# Altium schematic sheet REDRIVERS.SchDoc
size A3; SheetNumber: 6; SheetTotal: 8
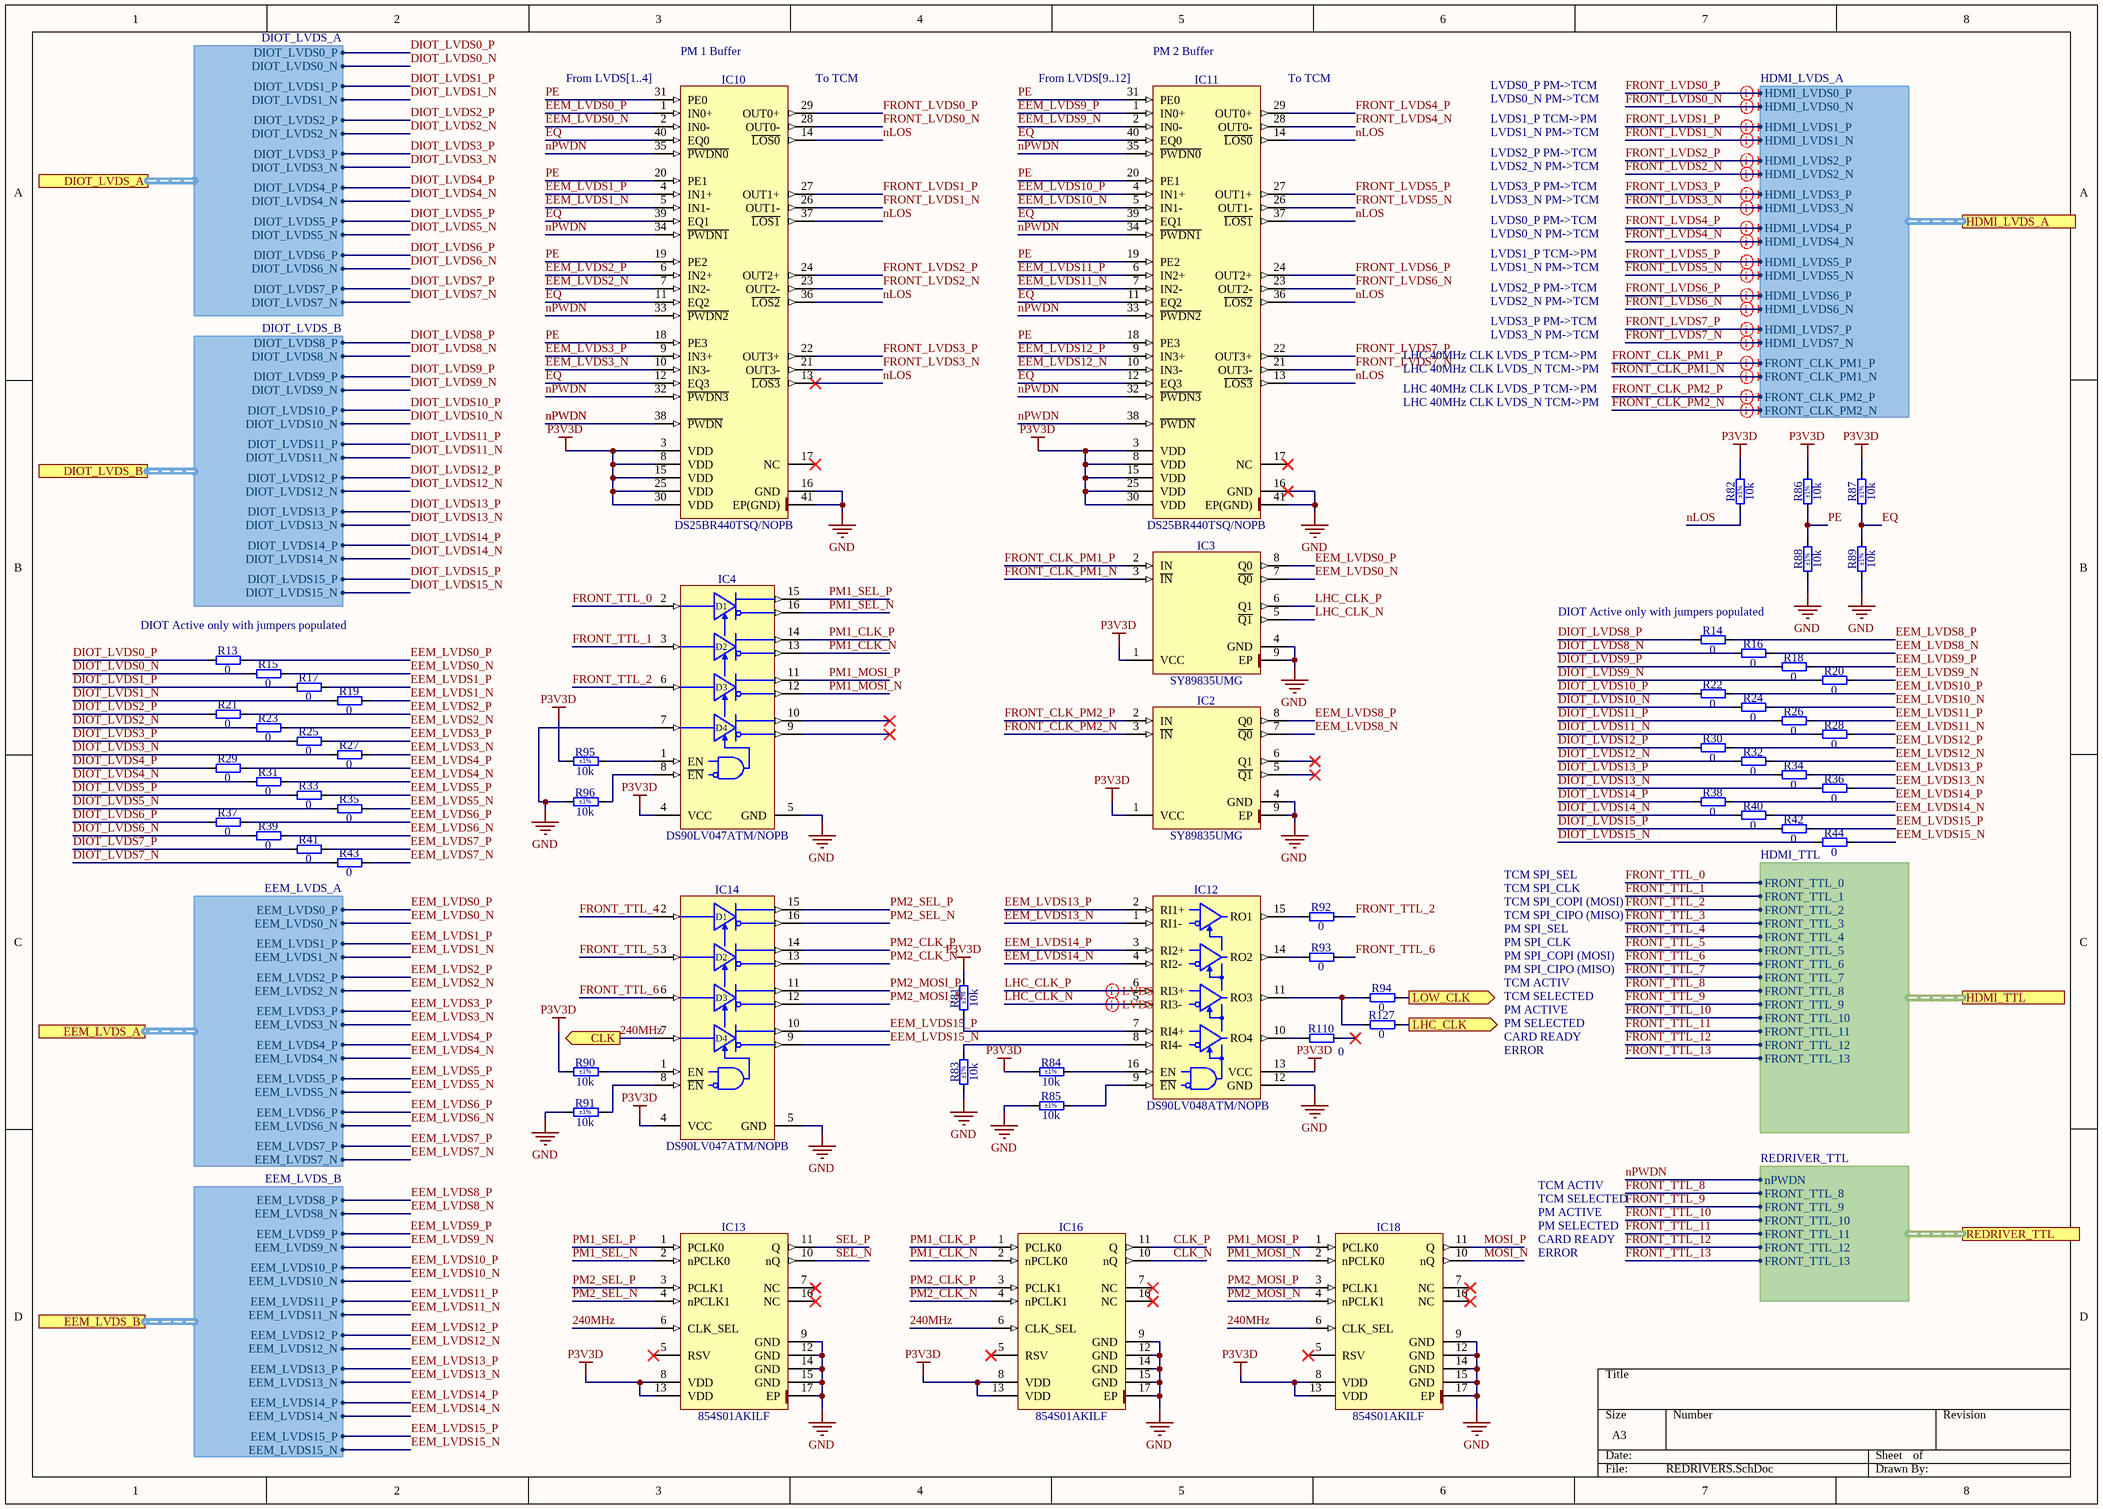
[diagram p0: REDRIVERS.SchDoc]

## Parts
IC2  SY89835UMG  [SON50P200X200X90-9N-R70X130]
IC3  SY89835UMG  [SON50P200X200X90-9N-R70X130]
IC4  DS90LV047ATM/NOPB  [SOIC127P600X175-16N]
IC10  DS25BR440TSQ/NOPB  [QFN50P600X600X80-41N-S480]
IC11  DS25BR440TSQ/NOPB  [QFN50P600X600X80-41N-S480]
IC12  DS90LV048ATM/NOPB  [SOIC127P600X175-16N]
IC13  854S01AKILF  [QFN50P300X300X100-17N-S180]
IC14  DS90LV047ATM/NOPB  [SOIC127P600X175-16N]
IC16  854S01AKILF  [QFN50P300X300X100-17N-S180]
IC18  854S01AKILF  [QFN50P300X300X100-17N-S180]
R13  0  [RESC1005X40N]
R14  0  [RESC1005X40N]
R15  0  [RESC1005X40N]
R16  0  [RESC1005X40N]
R17  0  [RESC1005X40N]
R18  0  [RESC1005X40N]
R19  0  [RESC1005X40N]
R20  0  [RESC1005X40N]
R21  0  [RESC1005X40N]
R22  0  [RESC1005X40N]
R23  0  [RESC1005X40N]
R24  0  [RESC1005X40N]
R25  0  [RESC1005X40N]
R26  0  [RESC1005X40N]
R27  0  [RESC1005X40N]
R28  0  [RESC1005X40N]
R29  0  [RESC1005X40N]
R30  0  [RESC1005X40N]
R31  0  [RESC1005X40N]
R32  0  [RESC1005X40N]
R33  0  [RESC1005X40N]
R34  0  [RESC1005X40N]
R35  0  [RESC1005X40N]
R36  0  [RESC1005X40N]
R37  0  [RESC1005X40N]
R38  0  [RESC1005X40N]
R39  0  [RESC1005X40N]
R40  0  [RESC1005X40N]
R41  0  [RESC1005X40N]
R42  0  [RESC1005X40N]
R43  0  [RESC1005X40N]
R44  0  [RESC1005X40N]
R81  10k  Tolerance: ±1%  [RESC1608X55N]
R82  10k  Tolerance: ±1%  [RESC1608X55N]
R83  10k  Tolerance: ±1%  [RESC1608X55N]
R84  10k  Tolerance: ±1%  [RESC1608X55N]
R85  10k  Tolerance: ±1%  [RESC1608X55N]
R86  10k  Tolerance: ±1%  [RESC1608X55N]
R87  10k  Tolerance: ±1%  [RESC1608X55N]
R88  10k  Tolerance: ±1%  [RESC1608X55N]
R89  10k  Tolerance: ±1%  [RESC1608X55N]
R90  10k  Tolerance: ±1%  [RESC1608X55N]
R91  10k  Tolerance: ±1%  [RESC1608X55N]
R92  0  [RESC1005X40N]
R93  0  [RESC1005X40N]
R94  0  [RESC1005X40N]
R95  10k  Tolerance: ±1%  [RESC1608X55N]
R96  10k  Tolerance: ±1%  [RESC1608X55N]
R110  0  [RESC1005X40N]
R127  0  [RESC1005X40N]

## Ports
CLK (out, see BLOCK_DIAGRAM[3B], CLK_GEN[6B]), DIOT_LVDS_A (harness DIOT_LVDS_A, see BLOCK_DIAGRAM[3A], DIOT_CONN[3C]), DIOT_LVDS_B (harness DIOT_LVDS_B, see BLOCK_DIAGRAM[3A], DIOT_CONN[6C]), EEM_LVDS_A (harness EEM_LVDS_A, see BLOCK_DIAGRAM[3C], EEM_CONN[3A]), EEM_LVDS_B (harness EEM_LVDS_B, see BLOCK_DIAGRAM[3C], EEM_CONN[6A]), HDMI_LVDS_A (harness HDMI_LVDS_A, see BLOCK_DIAGRAM[3B], FRONT_CONN[8A]), HDMI_TTL (harness HDMI_TTL, see BLOCK_DIAGRAM[3B], FRONT_CONN[8C]), LHC_CLK (out, see BLOCK_DIAGRAM[3B], FRONT_CONN[2B]), LOW_CLK (out, see BLOCK_DIAGRAM[3B], CLK_GEN[2B]), REDRIVER_TTL (harness REDRIVER_TTL, see BLOCK_DIAGRAM[3C], SYSTEM[1D])

## Harnesses
DIOT_LVDS_A: DIOT_LVDS0_P, DIOT_LVDS0_N, DIOT_LVDS1_P, DIOT_LVDS1_N, DIOT_LVDS2_P, DIOT_LVDS2_N, DIOT_LVDS3_P, DIOT_LVDS3_N, DIOT_LVDS4_P, DIOT_LVDS4_N, DIOT_LVDS5_P, DIOT_LVDS5_N, DIOT_LVDS6_P, DIOT_LVDS6_N, DIOT_LVDS7_P, DIOT_LVDS7_N
DIOT_LVDS_B: DIOT_LVDS8_P, DIOT_LVDS8_N, DIOT_LVDS9_P, DIOT_LVDS9_N, DIOT_LVDS10_P, DIOT_LVDS10_N, DIOT_LVDS11_P, DIOT_LVDS11_N, DIOT_LVDS12_P, DIOT_LVDS12_N, DIOT_LVDS13_P, DIOT_LVDS13_N, DIOT_LVDS14_P, DIOT_LVDS14_N, DIOT_LVDS15_P, DIOT_LVDS15_N
EEM_LVDS_A: EEM_LVDS0_P, EEM_LVDS0_N, EEM_LVDS1_P, EEM_LVDS1_N, EEM_LVDS2_P, EEM_LVDS2_N, EEM_LVDS3_P, EEM_LVDS3_N, EEM_LVDS4_P, EEM_LVDS4_N, EEM_LVDS5_P, EEM_LVDS5_N, EEM_LVDS6_P, EEM_LVDS6_N, EEM_LVDS7_P, EEM_LVDS7_N
EEM_LVDS_B: EEM_LVDS8_P, EEM_LVDS8_N, EEM_LVDS9_P, EEM_LVDS9_N, EEM_LVDS10_P, EEM_LVDS10_N, EEM_LVDS11_P, EEM_LVDS11_N, EEM_LVDS12_P, EEM_LVDS12_N, EEM_LVDS13_P, EEM_LVDS13_N, EEM_LVDS14_P, EEM_LVDS14_N, EEM_LVDS15_P, EEM_LVDS15_N
REDRIVER_TTL: nPWDN, FRONT_TTL_8, FRONT_TTL_9, FRONT_TTL_10, FRONT_TTL_11, FRONT_TTL_12, FRONT_TTL_13
HDMI_LVDS_A: HDMI_LVDS0_P, HDMI_LVDS0_N, HDMI_LVDS1_P, HDMI_LVDS1_N, HDMI_LVDS2_P, HDMI_LVDS2_N, HDMI_LVDS3_P, HDMI_LVDS3_N, HDMI_LVDS4_P, HDMI_LVDS4_N, HDMI_LVDS5_P, HDMI_LVDS5_N, HDMI_LVDS6_P, HDMI_LVDS6_N, HDMI_LVDS7_P, HDMI_LVDS7_N, FRONT_CLK_PM1_P, FRONT_CLK_PM1_N, FRONT_CLK_PM2_P, FRONT_CLK_PM2_N
HDMI_TTL: FRONT_TTL_0, FRONT_TTL_1, FRONT_TTL_2, FRONT_TTL_3, FRONT_TTL_4, FRONT_TTL_5, FRONT_TTL_6, FRONT_TTL_7, FRONT_TTL_8, FRONT_TTL_9, FRONT_TTL_10, FRONT_TTL_11, FRONT_TTL_12, FRONT_TTL_13

## Nets
GND: IC2.4(GND) IC2.9(EP) IC3.4(GND) IC3.9(EP) IC4.5(GND) IC4.7(DIN4) IC10.16(GND) IC10.41(EP(GND)) IC11.16(GND) IC11.41(EP(GND)) IC12.12(GND) IC13.9(GND) IC13.12(GND) IC13.14(GND) IC13.15(GND) IC13.17(EP) IC14.5(GND) IC16.9(GND) IC16.12(GND) IC16.14(GND) IC16.15(GND) IC16.17(EP) IC18.9(GND) IC18.12(GND) IC18.14(GND) IC18.15(GND) IC18.17(EP) R83.1 R85.1 R88.1 R89.1 R91.2 R96.2
P3V3D: IC2.1(VCC) IC3.1(VCC) IC4.4(VCC) IC10.3(VDD) IC10.8(VDD) IC10.15(VDD) IC10.25(VDD) IC10.30(VDD) IC11.3(VDD) IC11.8(VDD) IC11.15(VDD) IC11.25(VDD) IC11.30(VDD) IC12.13(VCC) IC13.8(VDD) IC13.13(VDD) IC14.4(VCC) IC16.8(VDD) IC16.13(VDD) IC18.8(VDD) IC18.13(VDD) R81.2 R82.2 R84.1 R86.2 R87.2 R90.2 R95.2
240MHz: IC13.6(CLK_SEL) IC14.7(DIN4) IC16.6(CLK_SEL) IC18.6(CLK_SEL) ; port CLK
CLK_N: IC16.10(nQ)
CLK_P: IC16.11(Q)
DIOT_LVDS0_N: R15.1 ; port DIOT_LVDS_A.DIOT_LVDS0_N
DIOT_LVDS0_P: R13.1 ; port DIOT_LVDS_A.DIOT_LVDS0_P
DIOT_LVDS1_N: R19.1 ; port DIOT_LVDS_A.DIOT_LVDS1_N
DIOT_LVDS1_P: R17.1 ; port DIOT_LVDS_A.DIOT_LVDS1_P
DIOT_LVDS2_N: R23.1 ; port DIOT_LVDS_A.DIOT_LVDS2_N
DIOT_LVDS2_P: R21.1 ; port DIOT_LVDS_A.DIOT_LVDS2_P
DIOT_LVDS3_N: R27.1 ; port DIOT_LVDS_A.DIOT_LVDS3_N
DIOT_LVDS3_P: R25.1 ; port DIOT_LVDS_A.DIOT_LVDS3_P
DIOT_LVDS4_N: R31.1 ; port DIOT_LVDS_A.DIOT_LVDS4_N
DIOT_LVDS4_P: R29.1 ; port DIOT_LVDS_A.DIOT_LVDS4_P
DIOT_LVDS5_N: R35.1 ; port DIOT_LVDS_A.DIOT_LVDS5_N
DIOT_LVDS5_P: R33.1 ; port DIOT_LVDS_A.DIOT_LVDS5_P
DIOT_LVDS6_N: R39.1 ; port DIOT_LVDS_A.DIOT_LVDS6_N
DIOT_LVDS6_P: R37.1 ; port DIOT_LVDS_A.DIOT_LVDS6_P
DIOT_LVDS7_N: R43.1 ; port DIOT_LVDS_A.DIOT_LVDS7_N
DIOT_LVDS7_P: R41.1 ; port DIOT_LVDS_A.DIOT_LVDS7_P
DIOT_LVDS8_N: R16.1 ; port DIOT_LVDS_B.DIOT_LVDS8_N
DIOT_LVDS8_P: R14.1 ; port DIOT_LVDS_B.DIOT_LVDS8_P
DIOT_LVDS9_N: R20.1 ; port DIOT_LVDS_B.DIOT_LVDS9_N
DIOT_LVDS9_P: R18.1 ; port DIOT_LVDS_B.DIOT_LVDS9_P
DIOT_LVDS10_N: R24.1 ; port DIOT_LVDS_B.DIOT_LVDS10_N
DIOT_LVDS10_P: R22.1 ; port DIOT_LVDS_B.DIOT_LVDS10_P
DIOT_LVDS11_N: R28.1 ; port DIOT_LVDS_B.DIOT_LVDS11_N
DIOT_LVDS11_P: R26.1 ; port DIOT_LVDS_B.DIOT_LVDS11_P
DIOT_LVDS12_N: R32.1 ; port DIOT_LVDS_B.DIOT_LVDS12_N
DIOT_LVDS12_P: R30.1 ; port DIOT_LVDS_B.DIOT_LVDS12_P
DIOT_LVDS13_N: R36.1 ; port DIOT_LVDS_B.DIOT_LVDS13_N
DIOT_LVDS13_P: R34.1 ; port DIOT_LVDS_B.DIOT_LVDS13_P
DIOT_LVDS14_N: R40.1 ; port DIOT_LVDS_B.DIOT_LVDS14_N
DIOT_LVDS14_P: R38.1 ; port DIOT_LVDS_B.DIOT_LVDS14_P
DIOT_LVDS15_N: R44.1 ; port DIOT_LVDS_B.DIOT_LVDS15_N
DIOT_LVDS15_P: R42.1 ; port DIOT_LVDS_B.DIOT_LVDS15_P
EEM_LVDS0_N: IC3.7(~{Q0}) IC10.2(IN0-) R15.2 ; port EEM_LVDS_A.EEM_LVDS0_N
EEM_LVDS0_P: IC3.8(Q0) IC10.1(IN0+) R13.2 ; port EEM_LVDS_A.EEM_LVDS0_P
EEM_LVDS1_N: IC10.5(IN1-) R19.2 ; port EEM_LVDS_A.EEM_LVDS1_N
EEM_LVDS1_P: IC10.4(IN1+) R17.2 ; port EEM_LVDS_A.EEM_LVDS1_P
EEM_LVDS2_N: IC10.7(IN2-) R23.2 ; port EEM_LVDS_A.EEM_LVDS2_N
EEM_LVDS2_P: IC10.6(IN2+) R21.2 ; port EEM_LVDS_A.EEM_LVDS2_P
EEM_LVDS3_N: IC10.10(IN3-) R27.2 ; port EEM_LVDS_A.EEM_LVDS3_N
EEM_LVDS3_P: IC10.9(IN3+) R25.2 ; port EEM_LVDS_A.EEM_LVDS3_P
EEM_LVDS4_N: R31.2 ; port EEM_LVDS_A.EEM_LVDS4_N
EEM_LVDS4_P: R29.2 ; port EEM_LVDS_A.EEM_LVDS4_P
EEM_LVDS5_N: R35.2 ; port EEM_LVDS_A.EEM_LVDS5_N
EEM_LVDS5_P: R33.2 ; port EEM_LVDS_A.EEM_LVDS5_P
EEM_LVDS6_N: R39.2 ; port EEM_LVDS_A.EEM_LVDS6_N
EEM_LVDS6_P: R37.2 ; port EEM_LVDS_A.EEM_LVDS6_P
EEM_LVDS7_N: R43.2 ; port EEM_LVDS_A.EEM_LVDS7_N
EEM_LVDS7_P: R41.2 ; port EEM_LVDS_A.EEM_LVDS7_P
EEM_LVDS8_N: IC2.7(~{Q0}) R16.2 ; port EEM_LVDS_B.EEM_LVDS8_N
EEM_LVDS8_P: IC2.8(Q0) R14.2 ; port EEM_LVDS_B.EEM_LVDS8_P
EEM_LVDS9_N: IC11.2(IN0-) R20.2 ; port EEM_LVDS_B.EEM_LVDS9_N
EEM_LVDS9_P: IC11.1(IN0+) R18.2 ; port EEM_LVDS_B.EEM_LVDS9_P
EEM_LVDS10_N: IC11.5(IN1-) R24.2 ; port EEM_LVDS_B.EEM_LVDS10_N
EEM_LVDS10_P: IC11.4(IN1+) R22.2 ; port EEM_LVDS_B.EEM_LVDS10_P
EEM_LVDS11_N: IC11.7(IN2-) R28.2 ; port EEM_LVDS_B.EEM_LVDS11_N
EEM_LVDS11_P: IC11.6(IN2+) R26.2 ; port EEM_LVDS_B.EEM_LVDS11_P
EEM_LVDS12_N: IC11.10(IN3-) R32.2 ; port EEM_LVDS_B.EEM_LVDS12_N
EEM_LVDS12_P: IC11.9(IN3+) R30.2 ; port EEM_LVDS_B.EEM_LVDS12_P
EEM_LVDS13_N: IC12.1(RI1-) R36.2 ; port EEM_LVDS_B.EEM_LVDS13_N
EEM_LVDS13_P: IC12.2(RI1+) R34.2 ; port EEM_LVDS_B.EEM_LVDS13_P
EEM_LVDS14_N: IC12.4(RI2-) R40.2 ; port EEM_LVDS_B.EEM_LVDS14_N
EEM_LVDS14_P: IC12.3(RI2+) R38.2 ; port EEM_LVDS_B.EEM_LVDS14_P
EEM_LVDS15_N: IC14.9(DOUT4-) R44.2 ; port EEM_LVDS_B.EEM_LVDS15_N
EEM_LVDS15_P: IC14.10(DOUT4+) R42.2 ; port EEM_LVDS_B.EEM_LVDS15_P
EQ: IC10.11(EQ2) IC10.12(EQ3) IC10.39(EQ1) IC10.40(EQ0) IC11.11(EQ2) IC11.12(EQ3) IC11.39(EQ1) IC11.40(EQ0) R87.1 R89.2
FRONT_CLK_PM1_N: IC3.3(~{IN}) ; port HDMI_LVDS_A.FRONT_CLK_PM1_N
FRONT_CLK_PM1_P: IC3.2(IN) ; port HDMI_LVDS_A.FRONT_CLK_PM1_P
FRONT_CLK_PM2_N: IC2.3(~{IN}) ; port HDMI_LVDS_A.FRONT_CLK_PM2_N
FRONT_CLK_PM2_P: IC2.2(IN) ; port HDMI_LVDS_A.FRONT_CLK_PM2_P
FRONT_LVDS0_N: IC10.28(OUT0-) ; port HDMI_LVDS_A.HDMI_LVDS0_N
FRONT_LVDS0_P: IC10.29(OUT0+) ; port HDMI_LVDS_A.HDMI_LVDS0_P
FRONT_LVDS1_N: IC10.26(OUT1-) ; port HDMI_LVDS_A.HDMI_LVDS1_N
FRONT_LVDS1_P: IC10.27(OUT1+) ; port HDMI_LVDS_A.HDMI_LVDS1_P
FRONT_LVDS2_N: IC10.23(OUT2-) ; port HDMI_LVDS_A.HDMI_LVDS2_N
FRONT_LVDS2_P: IC10.24(OUT2+) ; port HDMI_LVDS_A.HDMI_LVDS2_P
FRONT_LVDS3_N: IC10.21(OUT3-) ; port HDMI_LVDS_A.HDMI_LVDS3_N
FRONT_LVDS3_P: IC10.22(OUT3+) ; port HDMI_LVDS_A.HDMI_LVDS3_P
FRONT_LVDS4_N: IC11.28(OUT0-) ; port HDMI_LVDS_A.HDMI_LVDS4_N
FRONT_LVDS4_P: IC11.29(OUT0+) ; port HDMI_LVDS_A.HDMI_LVDS4_P
FRONT_LVDS5_N: IC11.26(OUT1-) ; port HDMI_LVDS_A.HDMI_LVDS5_N
FRONT_LVDS5_P: IC11.27(OUT1+) ; port HDMI_LVDS_A.HDMI_LVDS5_P
FRONT_LVDS6_N: IC11.23(OUT2-) ; port HDMI_LVDS_A.HDMI_LVDS6_N
FRONT_LVDS6_P: IC11.24(OUT2+) ; port HDMI_LVDS_A.HDMI_LVDS6_P
FRONT_LVDS7_N: IC11.21(OUT3-) ; port HDMI_LVDS_A.HDMI_LVDS7_N
FRONT_LVDS7_P: IC11.22(OUT3+) ; port HDMI_LVDS_A.HDMI_LVDS7_P
FRONT_TTL_0: IC4.2(DIN1) ; port HDMI_TTL.FRONT_TTL_0
FRONT_TTL_1: IC4.3(DIN2) ; port HDMI_TTL.FRONT_TTL_1
FRONT_TTL_2: IC4.6(DIN3) R92.2 ; port HDMI_TTL.FRONT_TTL_2
FRONT_TTL_3: port HDMI_TTL.FRONT_TTL_3
FRONT_TTL_4: IC14.2(DIN1) ; port HDMI_TTL.FRONT_TTL_4
FRONT_TTL_5: IC14.3(DIN2) ; port HDMI_TTL.FRONT_TTL_5
FRONT_TTL_6: IC14.6(DIN3) R93.2 ; port HDMI_TTL.FRONT_TTL_6
FRONT_TTL_7: port HDMI_TTL.FRONT_TTL_7
FRONT_TTL_8: port REDRIVER_TTL.FRONT_TTL_8, port HDMI_TTL.FRONT_TTL_8
FRONT_TTL_9: port REDRIVER_TTL.FRONT_TTL_9, port HDMI_TTL.FRONT_TTL_9
FRONT_TTL_10: port REDRIVER_TTL.FRONT_TTL_10, port HDMI_TTL.FRONT_TTL_10
FRONT_TTL_11: port REDRIVER_TTL.FRONT_TTL_11, port HDMI_TTL.FRONT_TTL_11
FRONT_TTL_12: port REDRIVER_TTL.FRONT_TTL_12, port HDMI_TTL.FRONT_TTL_12
FRONT_TTL_13: port REDRIVER_TTL.FRONT_TTL_13, port HDMI_TTL.FRONT_TTL_13
LHC_CLK: R127.2 ; port LHC_CLK
LHC_CLK_N: IC3.5(~{Q1}) IC12.5(RI3-)
LHC_CLK_P: IC3.6(Q1) IC12.6(RI3+)
LOW_CLK: R94.2 ; port LOW_CLK
MOSI_N: IC18.10(nQ)
MOSI_P: IC18.11(Q)
nLOS: IC10.13(~{LOS3}) IC10.14(~{LOS0}) IC10.36(~{LOS2}) IC10.37(~{LOS1}) IC11.13(~{LOS3}) IC11.14(~{LOS0}) IC11.36(~{LOS2}) IC11.37(~{LOS1}) R82.1
nPWDN: IC10.32(~{PWDN3}) IC10.33(~{PWDN2}) IC10.34(~{PWDN1}) IC10.35(~{PWDN0}) IC10.38(~{PWDN}) IC11.32(~{PWDN3}) IC11.33(~{PWDN2}) IC11.34(~{PWDN1}) IC11.35(~{PWDN0}) IC11.38(~{PWDN}) ; port REDRIVER_TTL.nPWDN
PE: IC10.18(PE3) IC10.19(PE2) IC10.20(PE1) IC10.31(PE0) IC11.18(PE3) IC11.19(PE2) IC11.20(PE1) IC11.31(PE0) R86.1 R88.2
PM1_CLK_N: IC4.13(DOUT2-) IC16.2(nPCLK0)
PM1_CLK_P: IC4.14(DOUT2+) IC16.1(PCLK0)
PM1_MOSI_N: IC4.12(DOUT3-) IC18.2(nPCLK0)
PM1_MOSI_P: IC4.11(DOUT3+) IC18.1(PCLK0)
PM1_SEL_N: IC4.16(DOUT1-) IC13.2(nPCLK0)
PM1_SEL_P: IC4.15(DOUT1+) IC13.1(PCLK0)
PM2_CLK_N: IC14.13(DOUT2-) IC16.4(nPCLK1)
PM2_CLK_P: IC14.14(DOUT2+) IC16.3(PCLK1)
PM2_MOSI_N: IC14.12(DOUT3-) IC18.4(nPCLK1)
PM2_MOSI_P: IC14.11(DOUT3+) IC18.3(PCLK1)
PM2_SEL_N: IC13.4(nPCLK1) IC14.16(DOUT1-)
PM2_SEL_P: IC13.3(PCLK1) IC14.15(DOUT1+)
SEL_N: IC13.10(nQ)
SEL_P: IC13.11(Q)
NetIC4_1: IC4.1(EN) R95.1
NetIC4_8: IC4.8(~{EN}) R96.1
NetIC12_7: IC12.7(RI4+) R81.1
NetIC12_8: IC12.8(RI4-) R83.2
NetIC12_9: IC12.9(~{EN}) R85.2
NetIC12_10: IC12.10(RO4) R110.1
NetIC12_11: IC12.11(RO3) R94.1 R127.1
NetIC12_14: IC12.14(RO2) R93.1
NetIC12_15: IC12.15(RO1) R92.1
NetIC12_16: IC12.16(EN) R84.2
NetIC14_1: IC14.1(EN) R90.1
NetIC14_8: IC14.8(~{EN}) R91.1

Not connected (* = marked no-connect by the designer): IC2 5(~{Q1})* 6(Q1)*; IC4 9(DOUT4-)* 10(DOUT4+)*; IC10 17(NC)*; IC11 17(NC)*; IC13 5(RSV)* 7(NC)* 16(NC)*; IC16 5(RSV)* 7(NC)* 16(NC)*; IC18 5(RSV)* 7(NC)* 16(NC)*; R110 2*

## Layout directives
differential pair; net class LVDS; differential pair class LVDS_DIFF: FRONT_CLK_PM1_N, FRONT_CLK_PM1_P, FRONT_CLK_PM2_N, FRONT_CLK_PM2_P, FRONT_LVDS0_N, FRONT_LVDS0_P, FRONT_LVDS1_N, FRONT_LVDS1_P, FRONT_LVDS2_N, FRONT_LVDS2_P, FRONT_LVDS3_N, FRONT_LVDS3_P, FRONT_LVDS4_N, FRONT_LVDS4_P, FRONT_LVDS5_N, FRONT_LVDS5_P, FRONT_LVDS6_N, FRONT_LVDS6_P, FRONT_LVDS7_N, FRONT_LVDS7_P, LHC_CLK_N, LHC_CLK_P

## Notes on the sheet
- (near IC10) From LVDS[1..4]
- (near IC10) PM 1 Buffer
- (near IC10) To TCM
- (near IC11) From LVDS[9..12]
- (near IC11) PM 2 Buffer
- (near IC11) To TCM
- LVDS0_P PM->TCM
- LVDS0_N PM->TCM
- LVDS1_P TCM->PM
- LVDS1_N PM->TCM
- LVDS2_P PM->TCM
- LVDS2_N PM->TCM
- LVDS3_P PM->TCM
- LVDS3_N PM->TCM
- LHC 40MHz CLK LVDS_P TCM->PM
- LHC 40MHz CLK LVDS_N TCM->PM
- DIOT Active only with jumpers populated
- TCM SPI_SEL
- TCM SPI_CLK
- TCM SPI_COPI (MOSI)
- TCM SPI_CIPO (MISO)
- PM SPI_SEL
- PM SPI_CLK
- PM SPI_COPI (MOSI)
- PM SPI_CIPO (MISO)
- TCM ACTIV
- TCM SELECTED
- PM ACTIVE
- PM SELECTED
- CARD READY
- ERROR
- (in symbol DS90LV047ATM/NOPB) D1; D2; D3; D4

## Library data of the parts
IC2 IC3 = SY89835UMG: 2.5V, 2GHz (3.2 Gbps) Ultra-Precision, Differential 1:2 LVDS Fanout Buffer With Internal Termination and Fail Safe Input; Manufacturer: MICREL; PressFit: No; Bonding: No; Part Number: SY89835UMG; Component Kind: Standard; Component Type: Standard; Device: SY89835UMG; PackageDescription: SON, 0.50mm Pitch; 8 Pin, 2.00mm W X 2.00mm L X 0.90mm H body (w/Thermal Tab 0.70 X 1.30mm), IPC Medium Density; Part Description: 2.5V, 2GHz (3.2 Gbps) Ultra-Precision, Differential 1:2 LVDS Fanout Buffer with Internal Termination and Fail Safe Input; Manufacturer Part Number: SY89835UMG; Pin Count: 9; Case: SON8; Mounted: Yes; Socket: No; SMD: Yes; Sense: No; ComponentHeight: 0.9mm; Author: CERN DEM MR; HelpURL: \\cern.ch\dfs\Applications\Altium\Datasheets\SY89835UMG.pdf; CreateDate: 22.04.2016; LatestRevisionDate: 22.04.2016
IC4 IC14 = DS90LV047ATM/NOPB: 3V LVDS Quad CMOS Differential Line Driver; Manufacturer: TEXAS INSTRUMENTS; PressFit: No; Bonding: No; Part Number: DS90LV047ATM/NOPB; Component Kind: Standard; Component Type: Standard; Device: DS90LV047ATM/NOPB; PackageDescription: SOIC 16, Pitch 1.27mm - Body 4x10mm, IPC Medium Density; Part Description: 3V LVDS Quad CMOS Differential Line Driver; Manufacturer Part Number: DS90LV047ATM; Pin Count: 16; Case: SOIC16; Mounted: Yes; Socket: No; SMD: Yes; Sense: No; ComponentHeight: 1.75mm; Author: CERN DEM JLC; HelpURL: \\cern.ch\dfs\Applications\Altium\Datasheets\DS90LV047ATM-NOPB.pdf; CreateDate: 02.07.2014; LatestRevisionDate: 01.06.2022
IC10 IC11 = DS25BR440TSQ/NOPB: 3.125-Gbps Quad LVDS Buffer with Transmit Pre-Emphasis and Receive Equalization; Manufacturer: TEXAS INSTRUMENTS; PressFit: No; Bonding: No; Part Number: DS25BR440TSQ/NOPB; Component Kind: Standard; Component Type: Standard; Device: DS25BR440TSQ/NOPB; PackageDescription: QFN, 0.50mm Pitch, Square; 40 Pin, 6.00mm L X 6.00mm W X 0.80mm H Body (w/Thermal Tab 4.80 x 4.80mm), IPC Medium Density; Part Description: 3.125-Gbps Quad LVDS Buffer with Transmit Pre-Emphasis and Receive Equalization; Manufacturer Part Number: DS25BR440TSQ; Pin Count: 41; Case: QFN40; Mounted: Yes; Socket: No; SMD: Yes; Sense: No; ComponentHeight: 0.8mm; Author: CERN DEM HF; HelpURL: \\cern.ch\dfs\Applications\Altium\Datasheets\DS25BR440TSQ-NOPB.pdf; CreateDate: 05.11.2021; LatestRevisionDate: 01.06.2022
IC12 = DS90LV048ATM/NOPB: 3V LVDS Quad CMOS Differential Line Receiver; Manufacturer: TEXAS INSTRUMENTS; PressFit: No; Bonding: No; Part Number: DS90LV048ATM/NOPB; Component Kind: Standard; Component Type: Standard; Device: DS90LV048ATM/NOPB; PackageDescription: SOIC 16, Pitch 1.27mm - Body 4x10mm, IPC Medium Density; Part Description: 3V LVDS Quad CMOS Differential Line Receiver; Manufacturer Part Number: DS90LV048ATM; Pin Count: 16; Case: SOIC16; Mounted: Yes; Socket: No; SMD: Yes; Sense: No; ComponentHeight: 1.75mm; Author: CERN DEM JLC; HelpURL: \\cern.ch\dfs\Applications\Altium\Datasheets\DS90LV048ATM-NOPB.pdf; CreateDate: 10.03.2014; LatestRevisionDate: 01.06.2022
IC13 IC16 IC18 = 854S01AKILF: 2:1 Differential-to-LVDS Multiplexer; Manufacturer: INTEGRATED DEVICE TECHNOLOGY (IDT); PressFit: No; Bonding: No; Part Number: 854S01AKILF; Component Kind: Standard; Component Type: Standard; Device: 854S01AKILF; PackageDescription: QFN, 0.50mm Pitch, Square; 16 Pin, 3.00mm L X 3.00mm W X 1.00mm H body (w/Thermal Tab 1.80 X 1.80mm), IPC Medium Density; Part Description: 2:1 Differential-to-LVDS Multiplexer; Manufacturer Part Number: 854S01AKILF; Pin Count: 17; Case: QFN16; Mounted: Yes; Socket: No; SMD: Yes; Sense: No; ComponentHeight: 1mm; Author: CERN DEM JLC; HelpURL: \\cern.ch\dfs\Applications\Altium\Datasheets\854S01AKILF.pdf; CreateDate: 23.02.2017; LatestRevisionDate: 23.02.2017
R13-R44 R92-R94 R110 R127 = R0402_0R_JUMPER: Resistor; Part Description: 1A (0.05R Max DC Resistance) Zero Ohm Jumper; Manufacturer: GENERIC; Manufacturer1 Part Number: 232270591001L; PressFit: No; Part Number: R0402_0R_JUMPER; Component Kind: Standard; Component Type: Standard; Pin Count: 2; Value: 0; Status: Not Recommended; Manufacturer Part Number: R0402_0R_JUMPER; Case: 0402; Mounted: Yes; Sense: No; Socket: No; SMD: Yes; Manufacturer1 Example: YAGEO PHYCOMP; Manufacturer1 ComponentHeight: 0.4mm; HelpURL: \\cern.ch\dfs\Applications\Altium\Datasheets\R0402_Phycomp_RC0402.pdf; Author: CERN DEM JLC; CreateDate: 03.12.2007; LatestRevisionDate: 17.10.2012
R81-R91 R95 R96 = R0603_10K_1%_0.1W_100PPM: Resistor - 1%; Part Description: General Purpose Thick Film Chip Resistor; Manufacturer: GENERIC; Manufacturer1 Part Number: NRC06F1002TRF; Power: 0.1W; TC: ±100ppm/°C; PressFit: No; Part Number: R0603_10K_1%_0.1W_100PPM; Component Kind: Standard; Component Type: Standard; Pin Count: 2; Value: 10k; Status: Preferred; Manufacturer Part Number: R0603_10K_1%_0.1W_100PPM; Case: 0603; Mounted: Yes; Sense: No; Socket: No; SMD: Yes; Manufacturer1 Example: NIC COMPONENT; Manufacturer1 ComponentHeight: 0.55mm; HelpURL: \\cern.ch\dfs\Applications\Altium\Datasheets\R0603_NIC_NRC.pdf; Author: CERN DEM JLC; CreateDate: 03.12.2007; LatestRevisionDate: 13.03.2008